# EAGLE schematic Laser_Charger (EAGLE 7.7.0)
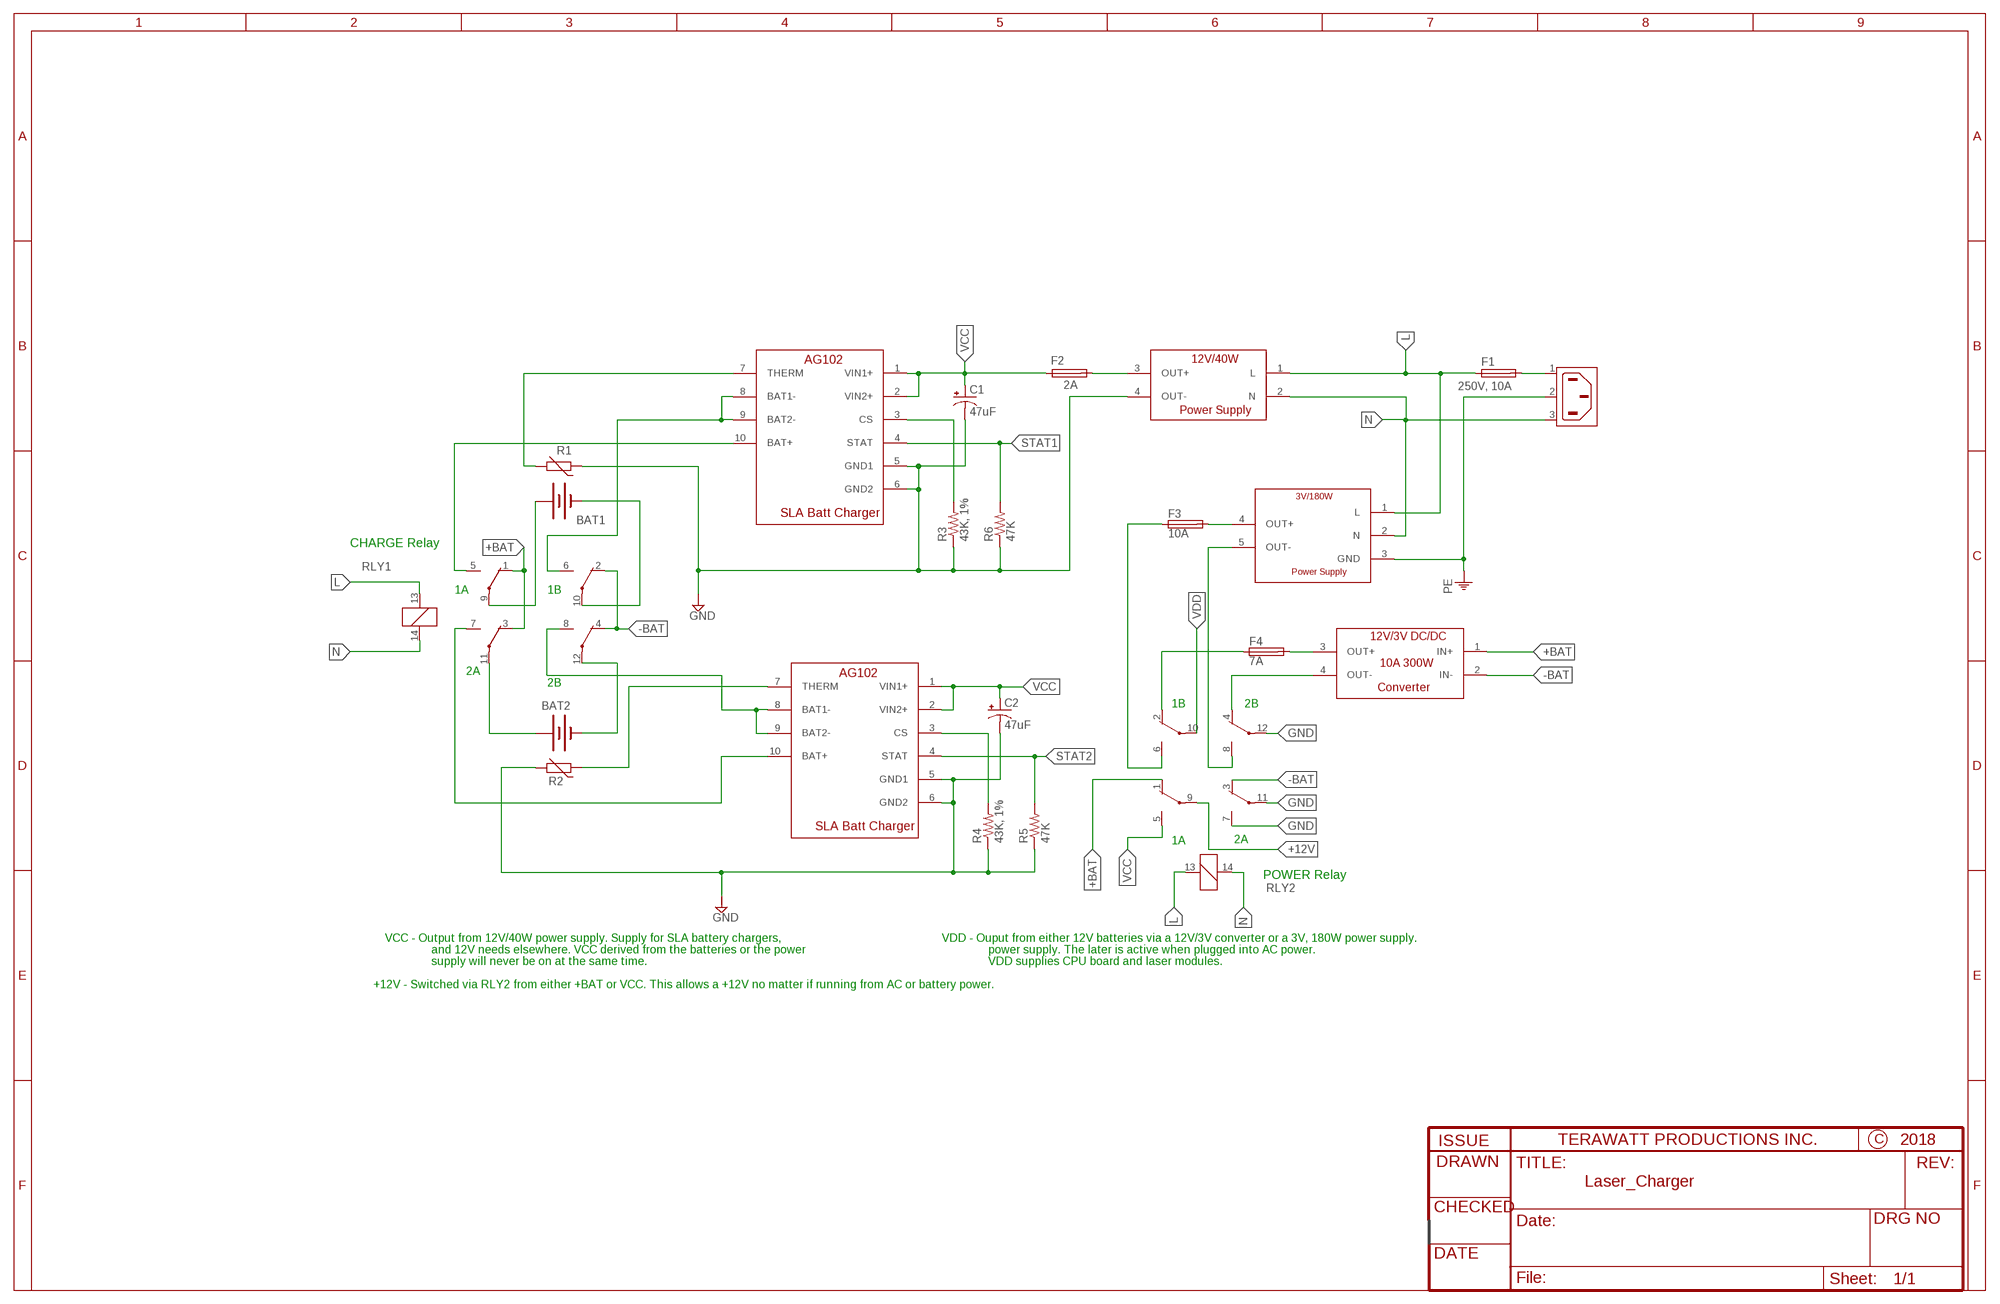
[diagram p0: schematic, sheet 1]

## Parts
BAT1  BATTERY  [12V_BATT]
BAT2  BATTERY  [12V_BATT]
C1  47uF  CPOL-USE5-10.5  [E5-10,5]
C2  47uF  CPOL-USE5-10.5  [E5-10,5]
CHG1  AG102_SLA_CHARGER  [22-23-2101]
CHG2  AG102_SLA_CHARGER  [22-23-2101]
F1  250V, 10A  SH22,5  [SH22,5]
F2  2A  SH22,5  [SH22,5]
F3  10A  SH22,5  [SH22,5]
F4  7A  SH22,5  [SH22,5]
P1  12V/3V_DC/DC_CONVERTER  [12V/3V_DC/DC_CONVERTER]
PS1  12V/40W_POWER_SUPPLY  [12V/40W_POWER_SUPPLY]
PS2  3V/180W_POWER_SUPPLY  [3V/180W_POWER_SUPPLY]
R1  THERMISTOR-2,5  [RS-2,5]
R2  THERMISTOR-2,5  [RS-2,5]
R3  43K, 1%  R-US_R0805  [R0805]
R4  43K, 1%  R-US_R0805  [R0805]
R5  47K  R-US_R0805  [R0805]
R6  47K  R-US_R0805  [R0805]
RLY1  4P4T_RELAYS  [22-23-2071-2]
RLY2  4P4T_RELAYS  [22-23-2071-2]
X1  6ESRM-P  [6ESRM-P]

## Nets
+12V: RLY2.9(1:P)
+BAT: P1.1(IN+) RLY1.1(1:O) RLY1.3(3:O) RLY2.1(1:O)
-BAT: P1.2(IN-) RLY1.2(2:O) RLY1.4(4:O) RLY2.3(3:O)
GND: C1.- C2.- CHG1.5(GND1) CHG1.6(GND2) CHG2.5(GND1) CHG2.6(GND2) PS1.4(OUT-) R1.1 R2.2 R3.1 R4.1 R5.1 R6.1 RLY2.7(3:S) RLY2.11(3:P) RLY2.12(4:P)
L: F1.1 PS1.1(L) PS2.1(L) RLY1.13 RLY2.13
N: PS1.2(N) PS2.2(N) RLY1.14 RLY2.14 X1.3(AC2)
N$1: P1.4(OUT-) RLY2.4(4:O)
N$2: F3.1 RLY2.6(2:S)
N$3: BAT1.1(+) RLY1.9(1:P)
N$4: BAT1.2(-) RLY1.10(2:P)
N$5: BAT2.1(+) RLY1.11(3:P)
N$6: CHG1.8(BAT1-) CHG1.9(BAT2-) RLY1.6(2:S)
N$7: CHG1.3(CS) R3.2
N$8: BAT2.2(-) RLY1.12(4:P)
N$9: F4.1 RLY2.2(2:O)
N$10: PS2.5(OUT-) RLY2.8(4:S)
N$11: CHG1.10(BAT+) RLY1.5(1:S)
N$12: CHG1.7(THERM) R1.2
N$13: CHG2.3(CS) R4.2
N$14: CHG2.7(THERM) R2.1
N$15: CHG2.8(BAT1-) CHG2.9(BAT2-) RLY1.8(4:S)
N$16: F1.2 X1.1(AC1)
N$17: CHG2.10(BAT+) RLY1.7(3:S)
N$18: F2.2 PS1.3(OUT+)
N$19: F3.2 PS2.4(OUT+)
N$20: F4.2 P1.3(OUT+)
PE: PS2.3(GND) X1.2(SH)
STAT1: CHG1.4(STAT) R6.2
STAT2: CHG2.4(STAT) R5.2
VCC: C1.+ C2.+ CHG1.1(VIN1+) CHG1.2(VIN2+) CHG2.1(VIN1+) CHG2.2(VIN2+) F2.1 RLY2.5(1:S)
VDD: RLY2.10(2:P)

## Notes on the sheet
- CHARGE Relay
- 1A | 1B
- 2A
- 2B
- 1B | 2B
- 1A | 2A
- POWER Relay
- VCC - Output from 12V/40W power supply. Supply for SLA battery chargers, | VDD - Ouput from either 12V batteries via a 12V/3V converter or a 3V, 180W power supply.
- and 12V needs elsewhere. VCC derived from the batteries or the power | power supply. The later is active when plugged into AC power.
- supply will never be on at the same time. | VDD supplies CPU board and laser modules.
- +12V - Switched via RLY2 from either +BAT or VCC. This allows a +12V no matter if running from AC or battery power.

## Library data of the parts
BAT1 BAT2 = Mine:BATTERY: BATTERY
C1 C2 = Mine:CPOL-US: POLARIZED CAPACITOR, American symbol
CHG1 CHG2 = Mine:AG102_SLA_CHARGER
F1-F4 = fuse:SH22,5: FUSE HOLDER grid 22,5 mm, OGN0031 8201, Schurter (Buerklin); MF: SCHURTER; MPN: 0031.8201; OC_FARNELL: 1162740; OC_NEWARK: 96F8317
P1 = Mine:12V/3V_DC/DC_CONVERTER
PS1 = Mine:12V/40W_POWER_SUPPLY: 12V/40W Power Supply.
PS2 = Mine:3V/180W_POWER_SUPPLY: 3V/180W power Supply.
R1 R2 = Mine:THERMISTOR: THERMISTOR
R3-R6 = rcl:R-US_: RESISTOR, American symbol
RLY1 RLY2 = Mine:4P4T_RELAYS: FLATPACK RELAY NAiS Source: http://www.mew-europe.com/.. en_ds_61014_0000.pdf
X1 = con-tycoelectronics:6ESRM-P: AC Connector 120/250 VAC Source: http://catalog.tycoelectronics.com .. ENG_DS_1654001_1099_SR_0406.pdf; MF: TYCO ELECTRONICS; MPN: 6ESRM-P; OC_FARNELL: unknown; OC_NEWARK: 87F1821